# EAGLE schematic irkit_v03 (EAGLE 6.4)
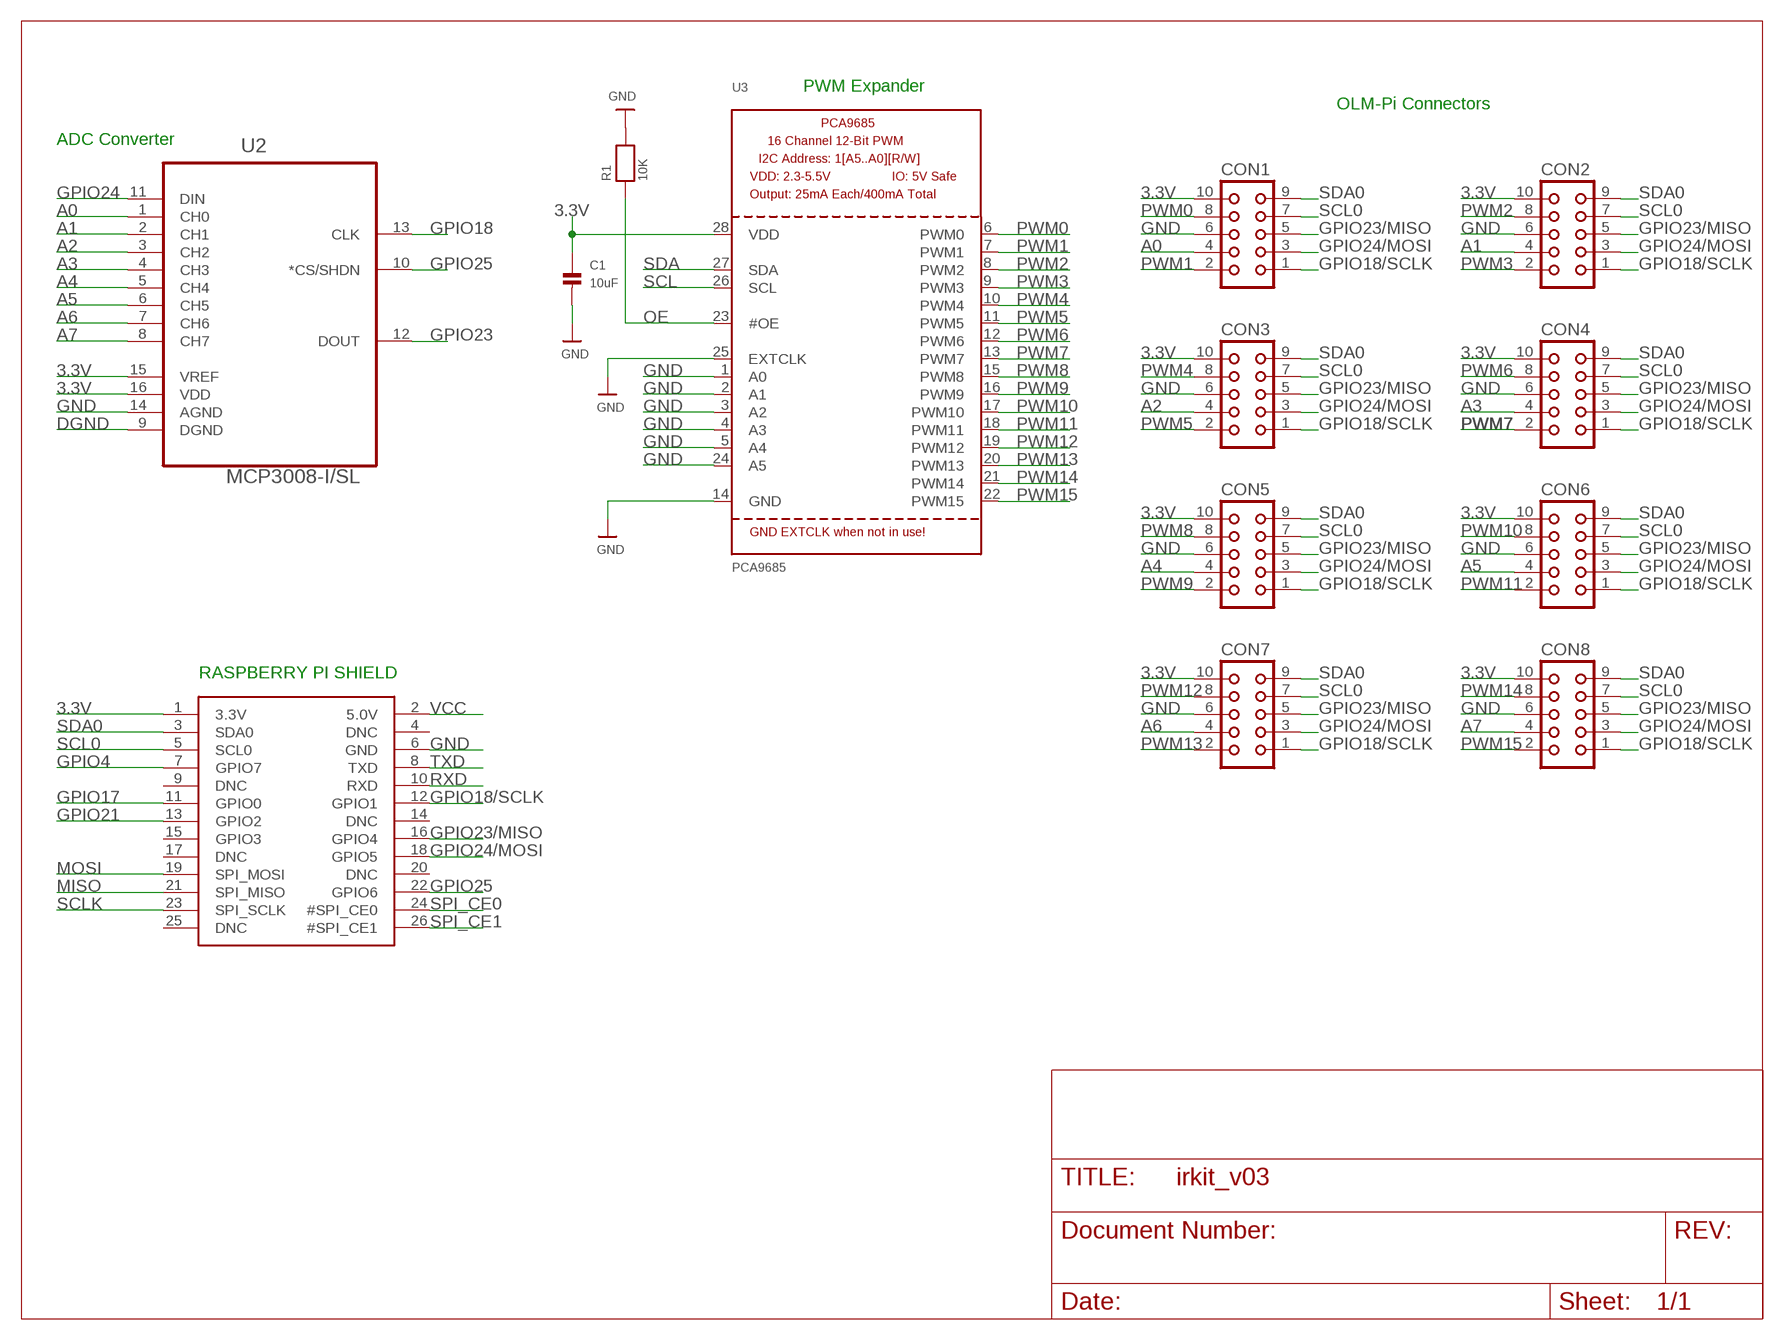
[diagram p0: schematic, sheet 1]

## Parts
C1  10uF  CAP_CERAMIC0805  [0805]
CON1  CON10L  [CON10L]
CON2  CON10L  [CON10L]
CON3  CON10L  [CON10L]
CON4  CON10L  [CON10L]
CON5  CON10L  [CON10L]
CON6  CON10L  [CON10L]
CON7  CON10L  [CON10L]
CON8  CON10L  [CON10L]
R1  10K  RESISTOR0805  [0805]
U2  MCP3008-I/SL  [SOIC127P600X175-16N]
U3  PCA9685  [TSSOP28]
U$1  RASPBERRYPI_BB  [RASBERRYPI_SHIELD]

## Nets
3.3V: C1.1 CON1.10 CON2.10 CON3.10 CON4.10 CON5.10 CON6.10 CON7.10 CON8.10 U2.15(VREF) U2.16(VDD) U3.28(VDD) U$1.1(3.3V)
A0: CON1.4 U2.1(CH0)
A1: CON2.4 U2.2(CH1)
A2: CON3.4 U2.3(CH2)
A3: CON4.4 U2.4(CH3)
A4: CON5.4 U2.5(CH4)
A5: CON6.4 U2.6(CH5)
A6: CON7.4 U2.7(CH6)
A7: CON8.4 U2.8(CH7)
DGND: U2.9(DGND)
GND: C1.2 CON1.6 CON2.6 CON3.6 CON4.6 CON5.6 CON6.6 CON7.6 CON8.6 R1.2 U2.14(AGND) U3.1(A0) U3.2(A1) U3.3(A2) U3.4(A3) U3.5(A4) U3.14(GND) U3.24(A5) U3.25(EXTCLK) U$1.6(GND)
GPIO4: U$1.7(GPIO7)
GPIO17: U$1.11(GPIO0)
GPIO18: U2.13(CLK)
GPIO18/SCLK: CON1.1 CON2.1 CON3.1 CON4.1 CON5.1 CON6.1 CON7.1 CON8.1 U$1.12(GPIO1)
GPIO21: U$1.13(GPIO2)
GPIO23: U2.12(DOUT)
GPIO23/MISO: CON1.5 CON2.5 CON3.5 CON4.5 CON5.5 CON6.5 CON7.5 CON8.5 U$1.16(GPIO4)
GPIO24: U2.11(DIN)
GPIO24/MOSI: CON1.3 CON2.3 CON3.3 CON4.3 CON5.3 CON6.3 CON7.3 CON8.3 U$1.18(GPIO5)
GPIO25: U2.10(*CS/SHDN) U$1.22(GPIO6)
MISO: U$1.21(SPI_MISO)
MOSI: U$1.19(SPI_MOSI)
OE: R1.1 U3.23(#OE)
PWM0: CON1.8 U3.6(PWM0)
PWM1: CON1.2 U3.7(PWM1)
PWM2: CON2.8 U3.8(PWM2)
PWM3: CON2.2 U3.9(PWM3)
PWM4: CON3.8 U3.10(PWM4)
PWM5: CON3.2 U3.11(PWM5)
PWM6: CON4.8 U3.12(PWM6)
PWM7: CON4.2 U3.13(PWM7)
PWM8: CON5.8 U3.15(PWM8)
PWM9: CON5.2 U3.16(PWM9)
PWM10: CON6.8 U3.17(PWM10)
PWM11: CON6.2 U3.18(PWM11)
PWM12: CON7.8 U3.19(PWM12)
PWM13: CON7.2 U3.20(PWM13)
PWM14: CON8.8 U3.21(PWM14)
PWM15: CON8.2 U3.22(PWM15)
RXD: U$1.10(RXD)
SCL: U3.26(SCL)
SCL0: CON1.7 CON2.7 CON3.7 CON4.7 CON5.7 CON6.7 CON7.7 CON8.7 U$1.5(SCL0)
SCLK: U$1.23(SPI_SCLK)
SDA: U3.27(SDA)
SDA0: CON1.9 CON2.9 CON3.9 CON4.9 CON5.9 CON6.9 CON7.9 CON8.9 U$1.3(SDA0)
SPI_CE0: U$1.24(#SPI_CE0)
SPI_CE1: U$1.26(#SPI_CE1)
TXD: U$1.8(TXD)
VCC: U$1.2(5.0V)
Unconnected: U$1.4(DNC) U$1.9(DNC) U$1.14(DNC) U$1.15(GPIO3) U$1.17(DNC) U$1.20(DNC) U$1.25(DNC)

## Notes on the sheet
- PWM Expander
- OLM-Pi Connectors
- ADC Converter
- RASPBERRY PI SHIELD

## Library data of the parts
C1 = microbuilder:CAP_CERAMIC: Ceramic Capacitors 0402 - 0402 Surface Mount Capacitors 16pF 50V 5% [Digikey: 445-4899-2-ND] 18pF 50V 5% [Digikey: 490-1281-2-ND] 22pF 50V 5% [Digikey: 490-1283-2-ND] 68pF 50V 5% [Digikey: 490-1289-2-ND] 0.1uF 10V 10% [Digikey: 490-1318-2-ND] 1.0uF 6.3V 10% [Digikey: 490-1320-2-ND] 0603 - 0603 Surface Mount Capacitors 16 pF 50V 5% [Digikey: 445-5051-2-ND] 22 pF 50V [Digikey: PCC220ACVTR-ND] 33 pF 50V 5% [Digikey: 490-1415-1-ND] 56pF 50V 5% [Digikey: 490-1421-1-ND] 220pF 50V 5% [Digikey: 445-1285-1-ND] 680 pF 50V 2200 pF 50V 5% C0G [Digikey: 445-1297-1-ND] 5600 pF 100V 5% X7R [Digikey: 478-3711-1-ND] 0.1 µF 25V 10% [Digikey: PCC2277TR-ND] 0.22 µF 16V 10% X7R [Digikey: 445-1318-1-ND] 1.0 µF 25V 10% [Digikey: 445-5146-2-ND] 0603 - RF Specific 3pF 250V +/-0.1pF RF [Digikey: 712-1347-1-ND] 18 pF 250V 5% [Digikey: 478-3505-1-ND or 712-1322-1-ND] 56 pF 250V 5% C0G RF [Digikey: 490-4867-1-ND] 68 pF 250V RF [Digikey: 490-4868-1-ND] 0805 - 0805 Surface Mount Capacitors 220 pF 250V 2% RF Ceramic Capacitor [Digikey: 712-1398-1-ND] 1000 pF 50V 2% NP0 Ceramic Capacitor [Digikey: 478-3760-1-ND] 0.1 µF 25V 10% Ceramic Capacitor [Digikey: PCC1828TR-ND] 1.0 µF 16V 10% Ceramic Capacitor[Digikey: 490-1691-2-ND] 10.0 µF 10V 10% Ceramic Capacitor[Digikey: 709-1228-1-ND] 10.0 uF 16V 10% Ceramic Capacitor [Digikey: 478-5165-2-ND] 47 uF 6.3V 20% Ceramic Capacitor [Digikey: 587-1779-1-ND or 399-5506-1-ND] 1206 - 1206 Surface Mount Capacitors 47uF 10V 20% Ceramic Capacitor [Digikey: 490-5528-1-ND or 399-5508-1-ND or 445-6010-1-ND] 100uF 6.3V -20%, +80% Y5V Ceramic Capacitor (Digikey: 490-4512-1-ND, Mouser: 81-GRM31CF50J107ZE1L)
CON1-CON8 = con-harting:CON10L: CONNECTOR; OC_FARNELL: unknown; OC_NEWARK: unknown
R1 = microbuilder:RESISTOR: Resistors 0402 - 0402 Surface Mount Package 22 Ohm 1% 1/16W [Digikey: 311-22.0LRTR-ND] 33 Ohm 5% 1/16W 1.0K 5% 1/16W 1.5K 5% 1/16W 2.0K 1% 1/16W 10.0K 1% 1/16W [Digikey: 311-10.0KLRTR-ND] 10.0K 5% 1/16W [Digikey: RMCF0402JT10K0TR-ND] 12.1K 1% 1/16W [Digikey: 311-22.0LRTR-ND] 100.0K 5% 1/16W 0603 - 0603 Surface Mount Package 0 Ohm 1/10 Watt 1% Resistor 15 Ohm 1/10 Watt 1% Resistor 33 Ohm 1/10 Watt 1% Resistor 49.9 Ohm 1/10 Watt 1% Resistor 100 Ohm 1/10 Watt 1% Resistor 150 Ohm 1/10 Watt 1% Resistor 240 Ohm 1/10 Watt 1% Resistor 390 Ohm 1/10 Watt 1% Resistor 560 Ohm 1/10 Watt 1% Resistor 680 Ohm 1/10 Watt 1% Resistor 750 Ohm 1/10 Watt 1% Resistor 1.0K Ohm 1/10 Watt 1% Resistor 1.5K Ohm 1/10 Watt 1% Resistor 2.0K Ohm 1/10 Watt 1% Resistor 2.2K Ohm 1/10 Watt 1% Resistor 3.3K Ohm 1/10 Watt 1% Resistor 4.7K Ohm 1/10 Watt 1% Resistor 10.0K Ohm 1/10 Watt 1% Resistor 12.0K Ohm 1/10 Watt 1% Resistor 12.1K Ohm 1/10 Watt 1% Resistor 20.0K Ohm 1/10 Watt 1% Resistor 33.0K Ohm 1/10 Watt 1% Resistor 100.0K Ohm 1/10 Watt 1% Resistor 0805 - 0805 Surface Mount Package 0 Ohm 1/8 Watt 1% Resistor 33 Ohm 1/8 Watt 1% Resistor 100 Ohm 1/8 Watt 1% Resistor 150 Ohm 1/8 Watt 1% Resistor 200 Ohm 1/8 Watt 1% Resistor 240 Ohm 1/8 Watt 1% Resistor 330 Ohm 1/8 Watt 1% Resistor 390 Ohm 1/8 Watt 1% Resistor 470 Ohm 1/8 Watt 1% Resistor 1.0K Ohm 1/8 Watt 1% Resistor 1.5K Ohm 1/8 Watt 1% Resistor 2.0K Ohm 1/8 Watt 1% Resistor 4.7K Ohm 1/8 Watt 1% Resistor 5.1K Ohm 1/8 Watt 1% Resistor 5.6K Ohm 1/8 Watt 1% Resistor 10.0K Ohm 1/8 Watt 1% Resistor 22.0K Ohm 1/8 Watt 1% Resistor 33.0K Ohm 1/8 Watt 1% Resistor 100K Ohm 1/8 Watt 1% Resistor 1206 - 1206 Surface Mount Package 2012 - 2010 Surface Mount Package 0.11 Ohm 1/2 Watt 1% Resistor - Digikey: RHM.11UCT-ND
U2 = Ava:MCP3008-I/SL: 10BIT ADC, 8 CH, SPI, SMD; MPN: MCP3008-I/SL; OC_FARNELL: 1292241; OC_NEWARK: 19C7201; PACKAGE: SOIC16; SUPPLIER: Microchip
U3 = microbuilder:PCA9685: PCA9685 - 16 Channel 12-Bit I2C PWM Controller 5.0V tolerant 16 channel, 12-bit I2C PWM controller with 25mA per output (max. 400mA total) Digikey: 568-5931-1-ND
U$1 = microbuilder1:RASPBERRYPI_B

## Net classes
1 power: width 0.813 mm, clearance 0.203 mm